# EAGLE design FM-Super-Regen (EAGLE 7.6.0)
Super-Regen FM Radio: "Radio Shack Special" http://ryanzachry.com/2013/01/super-regen-fm-radio/
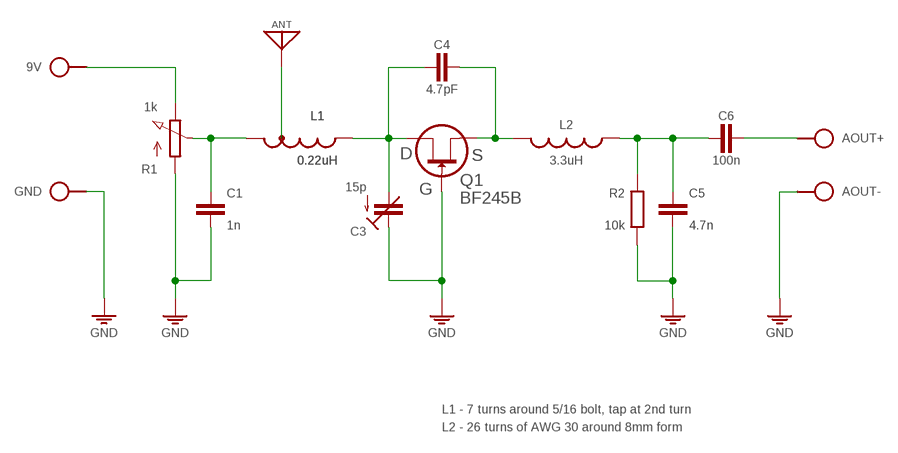
[diagram p0: schematic, sheet 1]

## Parts
9V  SPAD  [SPAD]
ANT  ANT  [SPAD]
AOUT+  SPAD  [SPAD]
AOUT-  SPAD  [SPAD]
C1  1n  C050-020X036/V  [C050-020X036/V]
C3  15p  C-TR-PH201272222-808-2PIN  [TRIM-2222-808]
C4  4.7pF  C050-020X036  [C050-020X036]
C5  4.7n  C050-020X044  [C050-020X044]
C6  100n  C050-020X044  [C050-020X044]
GND  SPAD  [SPAD]
L1  0.22uH  L-TAP1L-08/10-X-TAP1  [L-08/10-X-TAP1]
L2  3.3uH  L-BODY  [L-BODY]
Q1  BF245B  [TO92]
R1  1k  POT-V  [POT-V]
R2  10k  R0204/10  [0204/10]

## Nets
GND: AOUT-.1 C1.2 C3.1(E) C5.2 GND.1 Q1.1(G) R1.A R2.1
N$1: 9V.1 R1.E
N$2: C3.2(A) C4.1 L1.2 Q1.3(D)
N$3: C1.1 L1.1 R1.S
N$4: ANT.1 L1.3(T)
N$5: C4.2 L2.3 Q1.2(S)
N$6: C5.1 C6.1 L2.2 R2.2
N$8: AOUT+.1 C6.2

## Notes on the sheet
- L1 - 7 turns around 5/16 bolt, tap at 2nd turn
- L2 - 26 turns of AWG 30 around 8mm form

## Library data of the parts
9V AOUT+ AOUT- GND = pad:SPAD
ANT = pad:ANT
C1 C4-C6 = c:C: CAPACITOR, European symbol
C3 = cap-trim:C-TR-PH20127
L1 = l:L-TAP1
L2 = l:L: Potentiometers Beckman, Copal, Piher, Spectrol, Schukat Created by librarian@cadsoft.de
Q1 = t:BF245B: Transistors
R1 = r:POT
R2 = r:R: RESISTOR, European symbol

## Net classes
0 default: width 0.61 mm

## Board
Super-Regen FM Radio: "Radio Shack Special" http://ryanzachry.com/2013/01/super-regen-fm-radio/ http://electronics-diy.com/simple-fm-radio.php
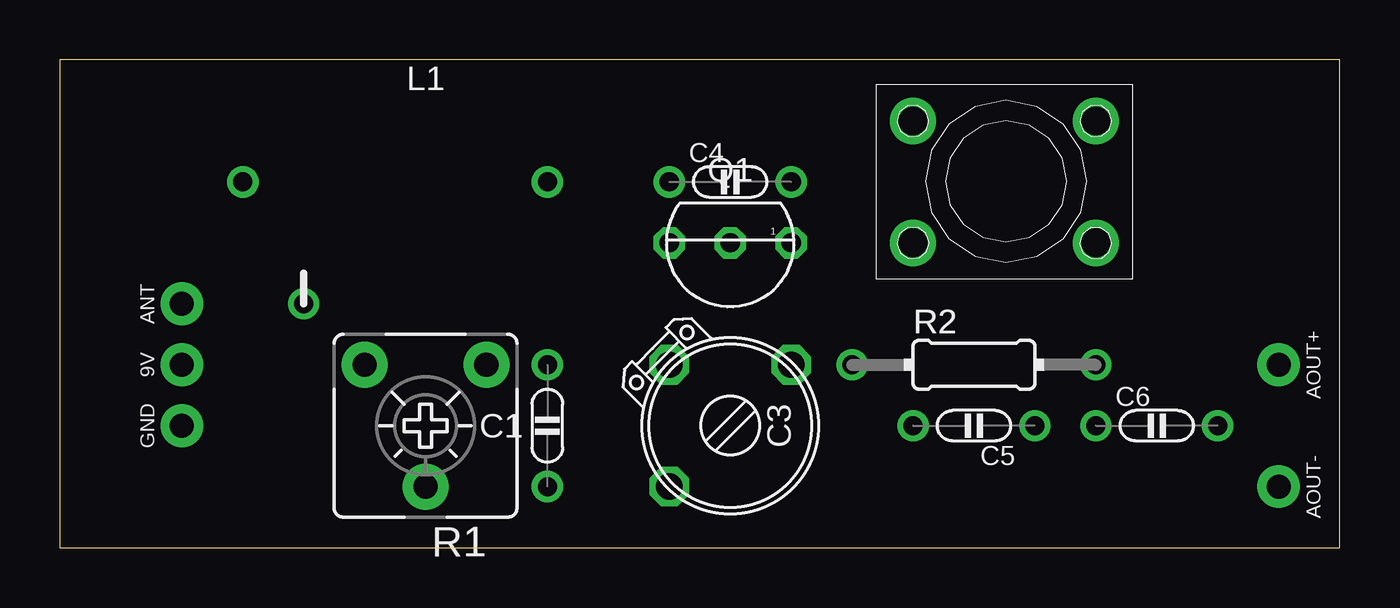
[diagram p1: board, top side]
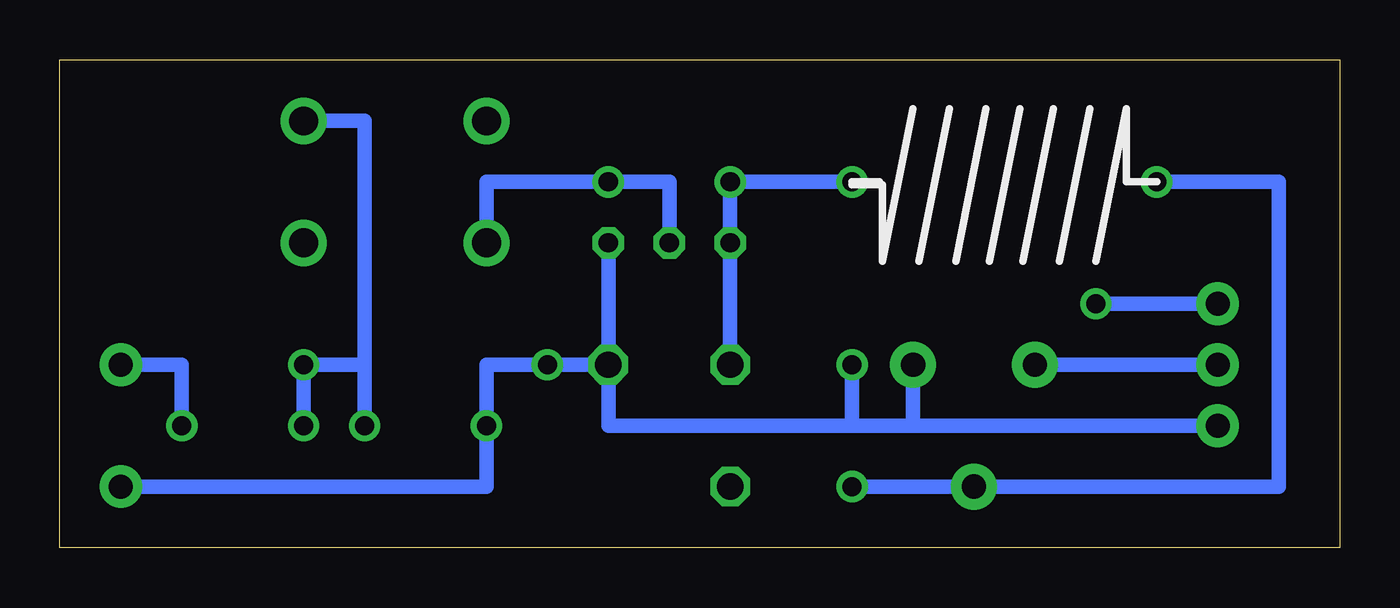
[diagram p2: board, bottom side, seen from below]

Size 53.34 x 20.32 mm. Coordinates in mm from the lower left corner, seen from the top.
Outline: 0,0 53.34,0 53.34,20.32 0,20.32 0,0
Copper layers (1*16): Top 0.035mm / dielectric 1.5mm / Bottom 0.035mm
Design rules "default": minimum track width 10mil, minimum drill 24mil, track to track 8mil, track to pad 8mil, pad to pad 8mil, via to via 8mil, smd to smd 8mil, copper to edge 40mil, drill to drill 8mil, minimum pad ring 10mil, minimum via ring 8mil, stop-mask expansion 4mil, vias tented up to drill 0mil, thermal gap 10mil

### Footprints (pad centres in the part's own frame; a part is rotated, then mirrored left to right if it is on the bottom)
SPAD = drill 1 pad 1.778: 1 0,0
C050-020X036/V = drill 0.8: 1 0,-2.54; 2 0,2.54
TRIM-2222-808 = drill 1.1 octagon: 1 -2.54,2.54; 2 -2.54,-2.54; 3 2.54,-2.54
C050-020X036 = drill 0.8: 1 -2.54,0; 2 2.54,0
L-08/10-TAP1 = drill 0.8: 1 -6.35,0; 2 6.35,0; 3 -3.81,-5.08
L-BODY = drill 1.2 pad 1.93: 1 -3.81,2.54; 2 3.81,2.54; 3 -3.81,-2.54; 4 3.81,-2.54
TO92 = drill 0.8 octagon: 1 -2.54,0; 2 0,0; 3 2.54,0
POT-V = drill 1.016 pad 1.93: A -2.54,-2.54; E 2.54,-2.54; S 0,2.54
0204/10 = drill 0.8: 1 -5.08,0; 2 5.08,0

### Placement (x,y rotation side)
9V  5.08,7.62 0 top
ANT  5.08,10.16 0 top
AOUT+  50.8,7.62 180 top
AOUT-  50.8,2.54 180 top
C1  20.32,5.08 0 top
C3  27.94,5.08 270 top
C4  27.94,15.24 0 top
C5  4.7n  [C050-020X036]  38.1,5.08 180 top
C6  100n  [C050-020X036]  45.72,5.08 0 top
GND  5.08,5.08 0 top
L1  0.22uH  [L-08/10-TAP1]  13.97,15.24 0 top
L2  39.37,15.24 0 top
Q1  27.94,12.7 180 top
R1  15.24,5.08 180 top
R2  38.1,7.62 0 top

### Tracks (layer width: path | path; a pad name or v marks a point on that pad's centre or on a via)
GND
  Bottom 0.61: 20.32,5.08 30.48,5.08 C3.1 | 17.78,6.35 R1.A 17.78,5.08 | 17.78,5.08 GND.1 | AOUT-.1 35.56,2.54 C5.2 35.56,7.62 R2.1 C3.1 | Q1.1 C3.1 | 17.78,5.08 20.32,5.08 | 20.32,5.08 C1.2
N$1
  Bottom 0.61: 9V.1 R1.E
N$2
  Bottom 0.61: C3.2 Q1.3 C4.1 L1.2
N$3
  Bottom 0.61: C1.1 R1.S 2.54,2.54 2.54,15.24 L1.1
N$4
  Bottom 0.61: ANT.1 L1.3
N$5
  Bottom 0.61: Q1.2 27.94,15.24 C4.2 35.56,15.24 L2.3
N$6
  Bottom 0.61: L2.2 40.64,17.78 40.64,7.62 | C5.1 40.64,7.62 | 40.64,7.62 R2.2 C6.1
N$8
  Bottom 0.61: C6.2 48.26,7.62 AOUT+.1